# EAGLE schematic usb_power_relay (EAGLE 7.7.0)
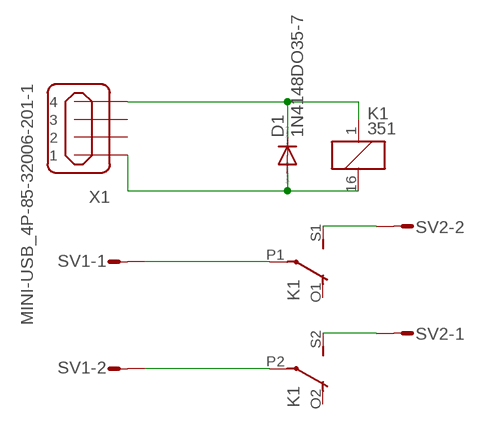
[diagram p0: schematic, sheet 1]

## Parts
D1  1N4148DO35-7  [DO35-7]
K1  351  [351]
SV1  S02P  [S02P]
SV2  S02P  [S02P]
X1  MINI-USB_4P-85-32006-201-1  [85-32006-201-1]

## Nets
N$1: D1.C K1.1 X1.4
N$2: D1.A K1.16 X1.1
N$3: K1.P1(2:P) SV1.1
N$4: K1.P2(3:P) SV1.2
N$5: K1.S1(2:S) SV2.2
N$6: K1.S2(3:S) SV2.1
Unconnected: K1.O1(2:O) K1.O2(3:O) X1.2 X1.3

## Library data of the parts
D1 = diode:1N4148: DIODE high speed (Philips)
K1 = relay:351: RELAY 2 x switch, Omron; OC_FARNELL: unknown; OC_NEWARK: unknown
SV1 SV2 = con-amp-mt:S02P: AMP MT CONNECTOR; OC_FARNELL: unknown; OC_NEWARK: unknown
X1 = con-cypressindustries:MINI-USB_4P-: MINI USB 4 Pol. Source: www.cypressindustries.com; OC_FARNELL: unknown; OC_NEWARK: unknown